# Altium schematic sheet HeatPlates.SchDoc
size B; SheetNumber: 6; SheetTotal: 7
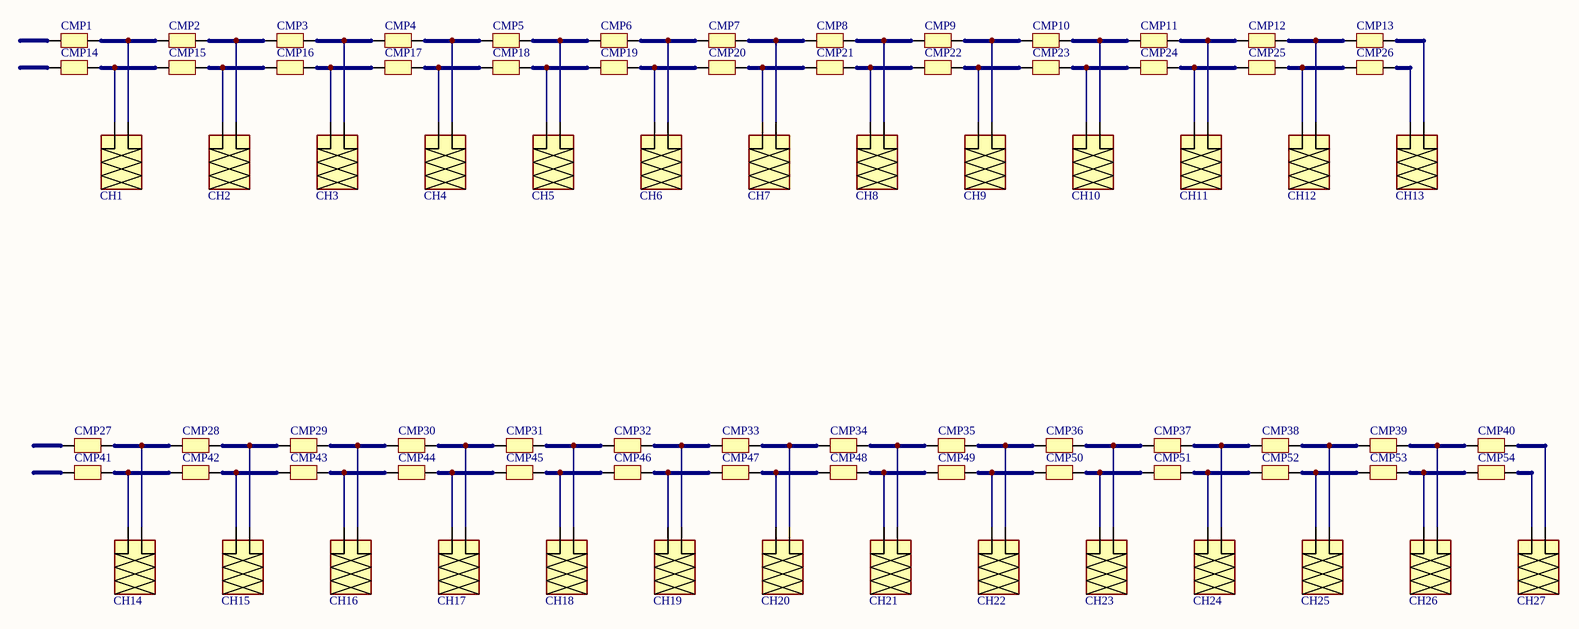
[diagram p0: HeatPlates.SchDoc]

## Parts
CH1  GCH  [Generic Cartridge Heater-Footprint-1]  (value not drawn)
CH2  GCH  [Generic Cartridge Heater-Footprint-1]  (value not drawn)
CH3  GCH  [Generic Cartridge Heater-Footprint-1]  (value not drawn)
CH4  GCH  [Generic Cartridge Heater-Footprint-1]  (value not drawn)
CH5  GCH  [Generic Cartridge Heater-Footprint-1]  (value not drawn)
CH6  GCH  [Generic Cartridge Heater-Footprint-1]  (value not drawn)
CH7  GCH  [Generic Cartridge Heater-Footprint-1]  (value not drawn)
CH8  GCH  [Generic Cartridge Heater-Footprint-1]  (value not drawn)
CH9  GCH  [Generic Cartridge Heater-Footprint-1]  (value not drawn)
CH10  GCH  [Generic Cartridge Heater-Footprint-1]  (value not drawn)
CH11  GCH  [Generic Cartridge Heater-Footprint-1]  (value not drawn)
CH12  GCH  [Generic Cartridge Heater-Footprint-1]  (value not drawn)
CH13  GCH  [Generic Cartridge Heater-Footprint-1]  (value not drawn)
CH14  GCH  [Generic Cartridge Heater-Footprint-1]  (value not drawn)
CH15  GCH  [Generic Cartridge Heater-Footprint-1]  (value not drawn)
CH16  GCH  [Generic Cartridge Heater-Footprint-1]  (value not drawn)
CH17  GCH  [Generic Cartridge Heater-Footprint-1]  (value not drawn)
CH18  GCH  [Generic Cartridge Heater-Footprint-1]  (value not drawn)
CH19  GCH  [Generic Cartridge Heater-Footprint-1]  (value not drawn)
CH20  GCH  [Generic Cartridge Heater-Footprint-1]  (value not drawn)
CH21  GCH  [Generic Cartridge Heater-Footprint-1]  (value not drawn)
CH22  GCH  [Generic Cartridge Heater-Footprint-1]  (value not drawn)
CH23  GCH  [Generic Cartridge Heater-Footprint-1]  (value not drawn)
CH24  GCH  [Generic Cartridge Heater-Footprint-1]  (value not drawn)
CH25  GCH  [Generic Cartridge Heater-Footprint-1]  (value not drawn)
CH26  GCH  [Generic Cartridge Heater-Footprint-1]  (value not drawn)
CH27  GCH  [Generic Cartridge Heater-Footprint-1]  (value not drawn)
CMP1  0192020054  [0192020054-Footprint-1]  (value not drawn)
CMP2  0192020054  [0192020054-Footprint-1]  (value not drawn)
CMP3  0192020054  [0192020054-Footprint-1]  (value not drawn)
CMP4  0192020054  [0192020054-Footprint-1]  (value not drawn)
CMP5  0192020054  [0192020054-Footprint-1]  (value not drawn)
CMP6  0192020054  [0192020054-Footprint-1]  (value not drawn)
CMP7  0192020054  [0192020054-Footprint-1]  (value not drawn)
CMP8  0192020054  [0192020054-Footprint-1]  (value not drawn)
CMP9  0192020054  [0192020054-Footprint-1]  (value not drawn)
CMP10  0192020054  [0192020054-Footprint-1]  (value not drawn)
CMP11  0192020054  [0192020054-Footprint-1]  (value not drawn)
CMP12  0192020054  [0192020054-Footprint-1]  (value not drawn)
CMP13  0192020054  [0192020054-Footprint-1]  (value not drawn)
CMP14  0192020054  [0192020054-Footprint-1]  (value not drawn)
CMP15  0192020054  [0192020054-Footprint-1]  (value not drawn)
CMP16  0192020054  [0192020054-Footprint-1]  (value not drawn)
CMP17  0192020054  [0192020054-Footprint-1]  (value not drawn)
CMP18  0192020054  [0192020054-Footprint-1]  (value not drawn)
CMP19  0192020054  [0192020054-Footprint-1]  (value not drawn)
CMP20  0192020054  [0192020054-Footprint-1]  (value not drawn)
CMP21  0192020054  [0192020054-Footprint-1]  (value not drawn)
CMP22  0192020054  [0192020054-Footprint-1]  (value not drawn)
CMP23  0192020054  [0192020054-Footprint-1]  (value not drawn)
CMP24  0192020054  [0192020054-Footprint-1]  (value not drawn)
CMP25  0192020054  [0192020054-Footprint-1]  (value not drawn)
CMP26  0192020054  [0192020054-Footprint-1]  (value not drawn)
CMP27  0192020054  [0192020054-Footprint-1]  (value not drawn)
CMP28  0192020054  [0192020054-Footprint-1]  (value not drawn)
CMP29  0192020054  [0192020054-Footprint-1]  (value not drawn)
CMP30  0192020054  [0192020054-Footprint-1]  (value not drawn)
CMP31  0192020054  [0192020054-Footprint-1]  (value not drawn)
CMP32  0192020054  [0192020054-Footprint-1]  (value not drawn)
CMP33  0192020054  [0192020054-Footprint-1]  (value not drawn)
CMP34  0192020054  [0192020054-Footprint-1]  (value not drawn)
CMP35  0192020054  [0192020054-Footprint-1]  (value not drawn)
CMP36  0192020054  [0192020054-Footprint-1]  (value not drawn)
CMP37  0192020054  [0192020054-Footprint-1]  (value not drawn)
CMP38  0192020054  [0192020054-Footprint-1]  (value not drawn)
CMP39  0192020054  [0192020054-Footprint-1]  (value not drawn)
CMP40  0192020054  [0192020054-Footprint-1]  (value not drawn)
CMP41  0192020054  [0192020054-Footprint-1]  (value not drawn)
CMP42  0192020054  [0192020054-Footprint-1]  (value not drawn)
CMP43  0192020054  [0192020054-Footprint-1]  (value not drawn)
CMP44  0192020054  [0192020054-Footprint-1]  (value not drawn)
CMP45  0192020054  [0192020054-Footprint-1]  (value not drawn)
CMP46  0192020054  [0192020054-Footprint-1]  (value not drawn)
CMP47  0192020054  [0192020054-Footprint-1]  (value not drawn)
CMP48  0192020054  [0192020054-Footprint-1]  (value not drawn)
CMP49  0192020054  [0192020054-Footprint-1]  (value not drawn)
CMP50  0192020054  [0192020054-Footprint-1]  (value not drawn)
CMP51  0192020054  [0192020054-Footprint-1]  (value not drawn)
CMP52  0192020054  [0192020054-Footprint-1]  (value not drawn)
CMP53  0192020054  [0192020054-Footprint-1]  (value not drawn)
CMP54  0192020054  [0192020054-Footprint-1]  (value not drawn)

## Nets
NetCH1_0: CH1.0 CMP14.1 CMP15.0
NetCH1_1: CH1.1 CMP1.1 CMP2.0
NetCH2_0: CH2.0 CMP15.1 CMP16.0
NetCH2_1: CH2.1 CMP2.1 CMP3.0
NetCH3_0: CH3.0 CMP16.1 CMP17.0
NetCH3_1: CH3.1 CMP3.1 CMP4.0
NetCH4_0: CH4.0 CMP17.1 CMP18.0
NetCH4_1: CH4.1 CMP4.1 CMP5.0
NetCH5_0: CH5.0 CMP18.1 CMP19.0
NetCH5_1: CH5.1 CMP5.1 CMP6.0
NetCH6_0: CH6.0 CMP19.1 CMP20.0
NetCH6_1: CH6.1 CMP6.1 CMP7.0
NetCH7_0: CH7.0 CMP20.1 CMP21.0
NetCH7_1: CH7.1 CMP7.1 CMP8.0
NetCH8_0: CH8.0 CMP21.1 CMP22.0
NetCH8_1: CH8.1 CMP8.1 CMP9.0
NetCH9_0: CH9.0 CMP22.1 CMP23.0
NetCH9_1: CH9.1 CMP9.1 CMP10.0
NetCH10_0: CH10.0 CMP23.1 CMP24.0
NetCH10_1: CH10.1 CMP10.1 CMP11.0
NetCH11_0: CH11.0 CMP24.1 CMP25.0
NetCH11_1: CH11.1 CMP11.1 CMP12.0
NetCH12_0: CH12.0 CMP25.1 CMP26.0
NetCH12_1: CH12.1 CMP12.1 CMP13.0
NetCH13_0: CH13.0 CMP26.1
NetCH13_1: CH13.1 CMP13.1
NetCH14_0: CH14.0 CMP41.1 CMP42.0
NetCH14_1: CH14.1 CMP27.1 CMP28.0
NetCH15_0: CH15.0 CMP42.1 CMP43.0
NetCH15_1: CH15.1 CMP28.1 CMP29.0
NetCH16_0: CH16.0 CMP43.1 CMP44.0
NetCH16_1: CH16.1 CMP29.1 CMP30.0
NetCH17_0: CH17.0 CMP44.1 CMP45.0
NetCH17_1: CH17.1 CMP30.1 CMP31.0
NetCH18_0: CH18.0 CMP45.1 CMP46.0
NetCH18_1: CH18.1 CMP31.1 CMP32.0
NetCH19_0: CH19.0 CMP46.1 CMP47.0
NetCH19_1: CH19.1 CMP32.1 CMP33.0
NetCH20_0: CH20.0 CMP47.1 CMP48.0
NetCH20_1: CH20.1 CMP33.1 CMP34.0
NetCH21_0: CH21.0 CMP48.1 CMP49.0
NetCH21_1: CH21.1 CMP34.1 CMP35.0
NetCH22_0: CH22.0 CMP49.1 CMP50.0
NetCH22_1: CH22.1 CMP35.1 CMP36.0
NetCH23_0: CH23.0 CMP50.1 CMP51.0
NetCH23_1: CH23.1 CMP36.1 CMP37.0
NetCH24_0: CH24.0 CMP51.1 CMP52.0
NetCH24_1: CH24.1 CMP37.1 CMP38.0
NetCH25_0: CH25.0 CMP52.1 CMP53.0
NetCH25_1: CH25.1 CMP38.1 CMP39.0
NetCH26_0: CH26.0 CMP53.1 CMP54.0
NetCH26_1: CH26.1 CMP39.1 CMP40.0
NetCH27_0: CH27.0 CMP54.1
NetCH27_1: CH27.1 CMP40.1

Not connected (* = marked no-connect by the designer): CMP1 0; CMP14 0; CMP27 0; CMP41 0

## Library data of the parts
CH1-CH27 = CMP-00030-00013-5: Generic cartridge heater; Pins: 2
CMP1-CMP54 = CMP-002-00129-2: Wire Terminal, 10.5mm2. Terminal Butt Splice, Inline, Individual Openings Connector Crimp 8 AWG Red; Manufacturer Series: 19202; Reach SVHC Compliant: Yes; RoHS Compliant: Yes; Terminal and Terminal Block Type: WIRE TERMINAL